# Altium schematic sheet Hambmark_PCB-practice-STM32-two-wheel-balancing-car__OTHER_SCHDOC__MPU6050.schdoc
size 59 x 55 mm
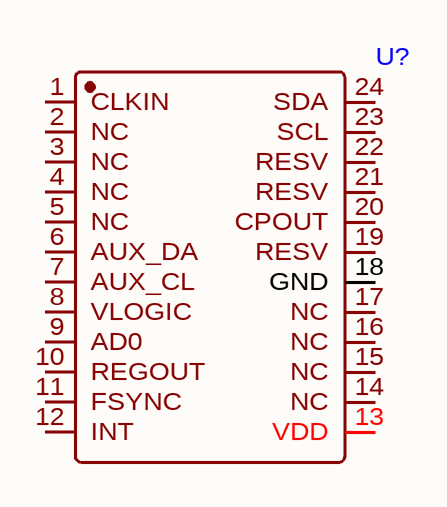
[diagram p0: Hambmark_PCB-practice-STM32-two-wheel-balancing-car__OTHER_SCHDOC__MPU6050.schdoc]

## Parts
U?  (no value)  [QFN-24_L4.0-W4.0-P0.50-BL]

## Nets

Not connected (* = marked no-connect by the designer): U? 1(CLKIN) 2(NC) 3(NC) 4(NC) 5(NC) 6(AUX_DA) 7(AUX_CL) 8(VLOGIC) 9(AD0) 10(REGOUT) 11(FSYNC) 12(INT) 13(VDD) 14(NC) 15(NC) 16(NC) 17(NC) 18(GND) 19(RESV) 20(CPOUT) 21(RESV) 22(RESV) 23(SCL) 24(SDA)

## Library data of the parts
U? = MPU6050_C9900042518